# Altium project PCB_Multimeter.PrjPcb
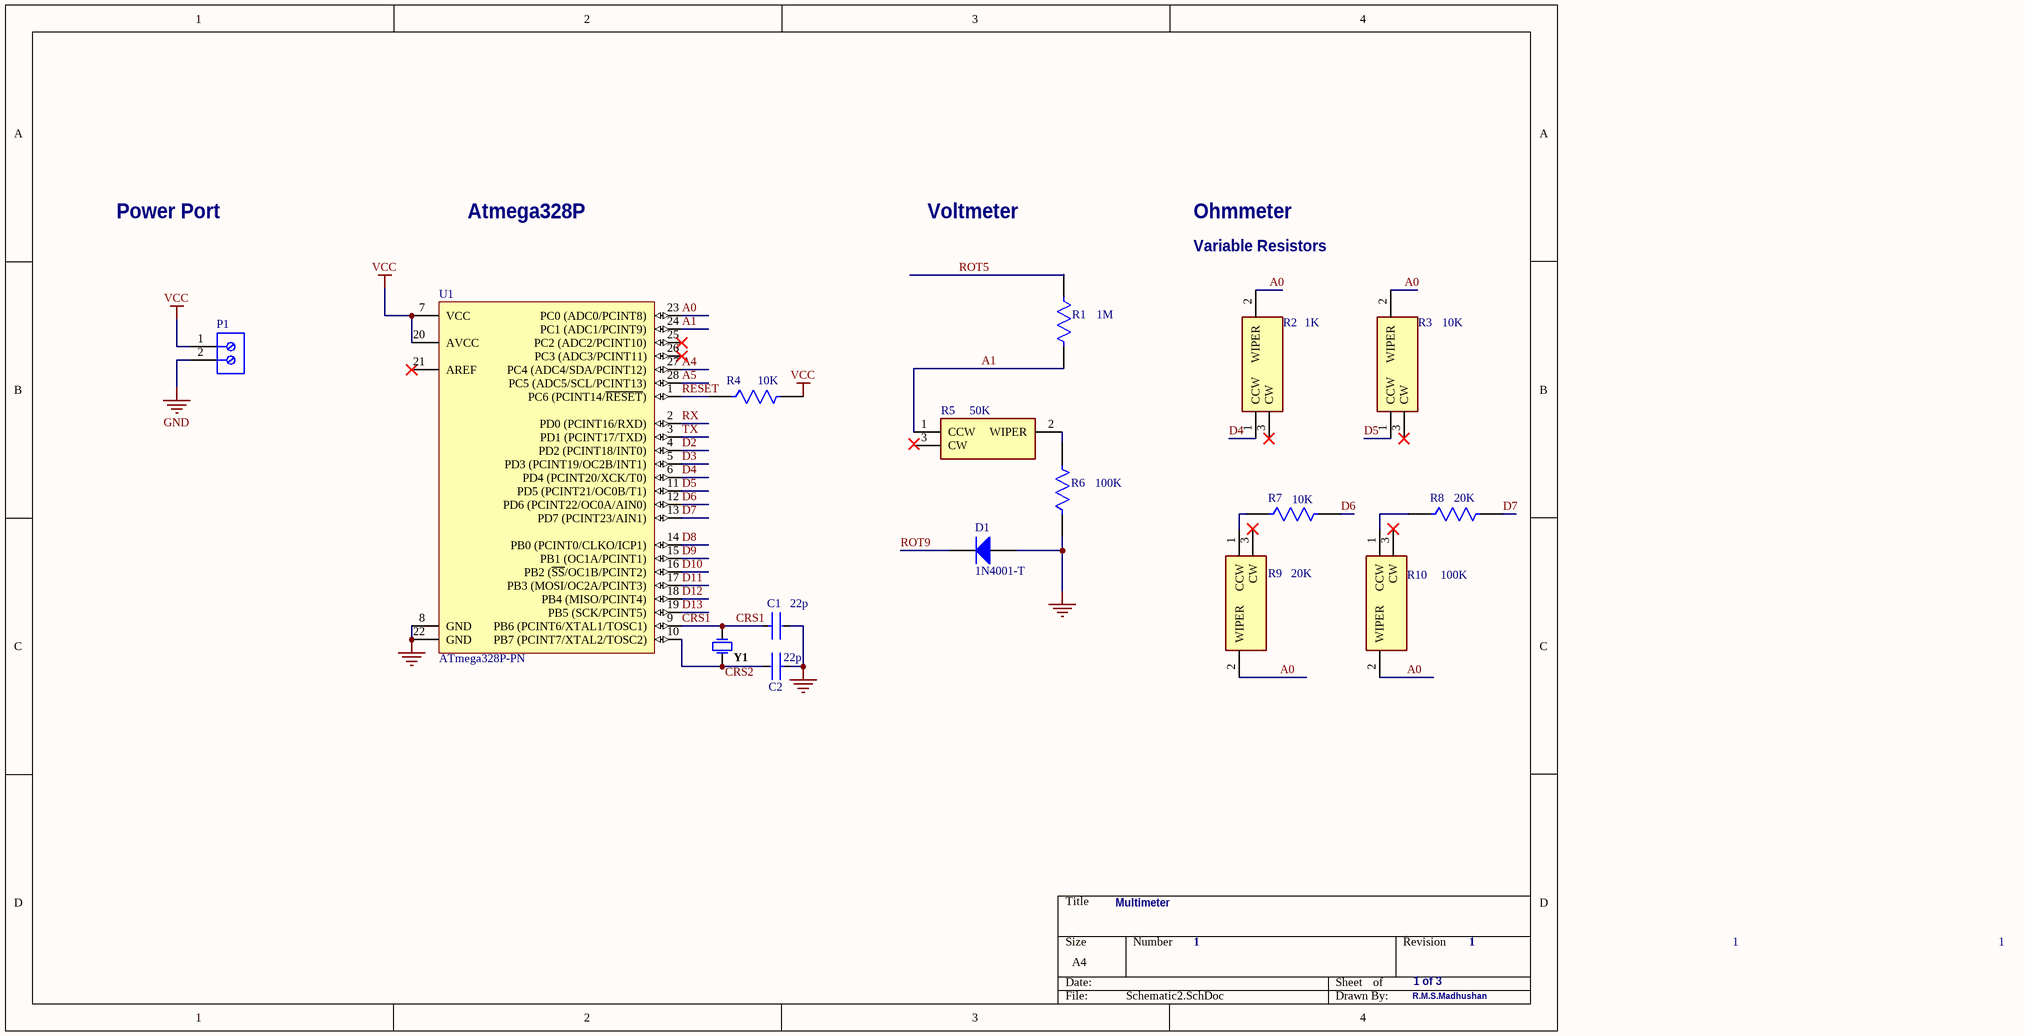
[diagram p0: Schematic2.SchDoc]
Start: 2023; Title: Multimeter
3 sheets, 46 parts. Net scope: global (net labels, ports and power ports of the same name join across sheets).
Board files: PCB1.PcbDoc, PCB2.PcbDoc
Sheets:
  Schematic2.SchDoc
  Sheet2.SchDoc
  Sheet3.SchDoc

## Sheet Schematic2.SchDoc: Multimeter
size A4; DrawnBy: R.M.S.Madhushan; SheetNumber: 1; SheetTotal: 3

### Parts
C1  22p  [FP-RDE0M1-MFG]
C2  22p  [FP-RDE0M1-MFG]
D1  1N4001-T  [DIOD-DO-41-P-2_V]
P1  691214110002  [691214110002]  (value not drawn)
R1  1M  [FP-G001R1000FE1280-MFG]
R2  1K  [3362P_1]
R3  10K  [3362P_1]
R4  10K  [FP-G001R1000FE1280-MFG]
R5  50K  [3362P_1]
R6  100K  [FP-G001R1000FE1280-MFG]
R7  10K  [FP-G001R1000FE1280-MFG]
R8  20K  [FP-G001R1000FE1280-MFG]
R9  20K  [3362P_1]
R10  100K  [3362P_1]
U1  ATmega328P-PN  [28P3]
Y1  FOXSLF/160-20  [FOX-FOXSLF160-20]  (value not drawn)

### Nets
GND: C1.2 C2.1 D1.1(A) P1.2 R6.1 U1.8(GND) U1.22(GND)
VCC: P1.1 R4.2 U1.7(VCC) U1.20(AVCC)
A0: R2.2(WIPER) R3.2(WIPER) R9.2(WIPER) R10.2(WIPER) U1.23(PC0_(ADC0/PCINT8))
A1: R1.2 R5.1(CCW) U1.24(PC1_(ADC1/PCINT9))
A4: U1.27(PC4_(ADC4/SDA/PCINT12))
A5: U1.28(PC5_(ADC5/SCL/PCINT13))
CRS1: C1.1 U1.9(PB6_(PCINT6/XTAL1/TOSC1)) Y1.1
D2: U1.4(PD2_(PCINT18/INT0))
D3: U1.5(PD3_(PCINT19/OC2B/INT1))
D4: R2.1(CCW) U1.6(PD4_(PCINT20/XCK/T0))
D5: R3.1(CCW) U1.11(PD5_(PCINT21/OC0B/T1))
D6: R7.2 U1.12(PD6_(PCINT22/OC0A/AIN0))
D7: R8.2 U1.13(PD7_(PCINT23/AIN1))
D8: U1.14(PB0_(PCINT0/CLKO/ICP1))
D9: U1.15(PB1_(OC1A/PCINT1))
D10: U1.16(PB2_(~{SS}/OC1B/PCINT2))
D11: U1.17(PB3_(MOSI/OC2A/PCINT3))
D12: U1.18(PB4_(MISO/PCINT4))
D13: U1.19(PB5_(SCK/PCINT5))
RESET: R4.1 U1.1(PC6_(PCINT14/~{RESET}))
ROT5: R1.1
ROT9: D1.2(K)
RX: U1.2(PD0_(PCINT16/RXD))
TX: U1.3(PD1_(PCINT17/TXD))
NetC2_2: C2.2 U1.10(PB7_(PCINT7/XTAL2/TOSC2)) Y1.2
NetR5_2: R5.2(WIPER) R6.2
NetR7_1: R7.1 R9.1(CCW)
NetR8_1: R8.1 R10.1(CCW)

Not connected (* = marked no-connect by the designer): R2 3(CW)*; R3 3(CW)*; R5 3(CW); R9 3(CW)*; R10 3(CW)*; U1 21(AREF)* 25(PC2_(ADC2/PCINT10))* 26(PC3_(ADC3/PCINT11))*

### Notes on the sheet
- Power Port
- Atmega328P
- Voltmeter
- Ohmmeter
- Variable Resistors
- Multimeter
- 1
- 1 of 3
- Labels drawn without touching a wire or pin: CRS2

### Library data of the parts
C1 C2 = CMP-06035-055552-1: Ceramic Capacitor 22pF ±5% 50V C0G Radial; Lead Diameter: 0.5mm; Capacitance: 22pF; Width: 0.098inch; Dielectric: C0G; Length: 0.157inch; Max Operating Temperature: 125°C; Case/Package: Radial; Voltage Rating (DC): 50V; Lead Free: Lead Free; Voltage Rating: 50V; Termination: Radial; Mount: Through Hole; Tolerance: 5%; Resistor Type: Ceramic; Packaging: Bulk; Package Quantity: 500; Lead Pitch: 0.197inch; Min Operating Temperature: -55°C; Height - Seated (Max): 0.236inch; Height: 3.5mm
D1 = CMP-0639-00006-2: 1.0 A Rectifier, 15 pF, 50 V, -65 to 150 degC, 2-Pin DO-41 Plastic, RoHS, Tape and Reel; Manufacturer: Diodes Inc; VF (V): 1; CT (pF): 15; Max. IR (uA): 5; VRRM (V): 50; Max. IFSM (A): 30; RoHS: TRUE; Mounting Technology: Through Hole; PartNumber: 1N4001-T; ComponentLink2Description: Datasheet; DatasheetVersion: Rev. 8-2; Operating Temperature Range (degC): -65 to 150; Packing: Tape and Reel; PackageReference: DO-41-P-2; ComponentLink1URL: http://diodes.com/; PackageDescription: 2-Pin Axial Lead, Body 4.635 x 2.36 mm, Lead Spread 25.4 mm; ComponentLink2URL: http://diodes.com/datasheets/ds28002.pdf; Max. Average Rectified Current IO (A): 1; ComponentLink1Description: Manufacturer URL
P1 = CMP-1502-02464-1: Serie 2141 - 3.50 mm Horizontal Entry Modular with Rising Cage Clamp WR-TBL, 2 pin; Manufacturer: Wurth Elektronik; Pin Number: 2; Pitch: 3.50mm; Datasheet URL: http://katalog.we-online.de/em/datasheet/6912141100xx.pdf; Packaging: Box; Mounting Technology: THT; Package Reference: 691214110002; Manufacturer URL: http://www.we-online.de; Part Number: 691214110002; Publisher: WurthElektronik; Operating Temperature: -40to105degC
R1 R4 R6-R8 = CMP-02408-000025-1: Res Wirewound 0.1 Ohm 1% 1W ±90ppm/°C Ceramic Hi Temp Sil AXL Thru-Hole Bulk; Resistance: 100mR; Case/Package: Ceramic; Construction: Cylindrical; Diameter: 2.16mm; Series: G; Tolerance: 1%; Max Operating Temperature: 250°C; Lead Free: Lead Free; Resistor Type: Wirewound; Contact Plating: Tin; Mount: Through Hole; Radiation Hardening: No; RoHS Compliant: Yes; Termination: Axial; Temperature Coefficient: 90ppm/°C; Min Operating Temperature: -65°C; Length: 7.14mm; Military Standard: Not; Packaging: Tape and Reel; Power Rating: 1W
R2 R3 R5 R9 R10 = 3362P-1-203LF: Resistor; Manufacturer_Name: Bourns; Datasheet Link: https://www.bourns.com/docs/Product-Datasheets/3362.pdf; Manufacturer_Part_Number: 3362P-1-203LF; Mouser Part Number: 652-3362P-1-203LF; Mouser Price/Stock: https://www.mouser.co.uk/ProductDetail/Bourns/3362P-1-203LF?qs=GslmPyR0hhF1JBua3W6Xbw%3D%3D; Arrow Part Number: 3362P-1-203LF; Arrow Price/Stock: https://www.arrow.com/en/products/3362p-1-203lf/bourns?region=europe
U1 = CMP-0095-00355-1: 8-bit AVR Microcontroller, 32KB Flash, 1KB EEPROM, 2KB SRAM, 28-pin PDIP, Industrial Grade (-40°C to 105°C); PackageVersion: revB, Sep-2001; ComponentLink1Description: Manufacturer URL; ComponentLink1URL: http://www.atmel.com/; ComponentLink2URL: http://www.atmel.com/dyn/resources/prod_documents/8271.pdf; PackageDescription: 28-lead (0.300"/7.62mm Wide) Plastic Dual Inline Package (PDIP); ComponentLink2Description: ATmega48A/48PA/88A/88PA/168A/168PA/328/328P Datasheet; ComponentLink3Description: ATmega48A/48PA/88A/88PA/168A/168PA/328/328P Summary; DatasheetVersion: revD, May-2011; ComponentLink3URL: http://www.atmel.com/dyn/resources/prod_documents/8271S.pdf; PackageReference: 28P3
Y1 = CMP-1749-00003-1: Resistance Weld Thru-Hole Crystal, 16 MHz, -20 to 70 degC, 2-Pin THD, RoHS, Bulk; Voltage Rating: 250 V; Tolerance: 1%; Resistance: 221 kohm; Case\Package: Axial; Power Rating: 250 mW; RoHSCompliant: true; Package Quantity: 200; Packaging: Bulk; Min Operating Temperature: -55 degC; DatasheetVersion: Mar-15; ComponentLink1URL: http://www.foxonline.com/; Max Operating Temperature: 155 degC; PackageReference: FOXSLF160-20; Mount: Through Hole; PackageDescription: 2-Pin Through Hole Device, Body 11.35 x 4.65 mm; ComponentLink1Description: Manufacturer URL; ComponentLink2URL: http://www.foxonline.com/pdfs/hc49slf.pdf; ComponentLink2Description: Datasheet; Length: 0.248 inch

## Sheet Sheet2.SchDoc: Multimeter
size A4; SheetNumber: 2; SheetTotal: 3
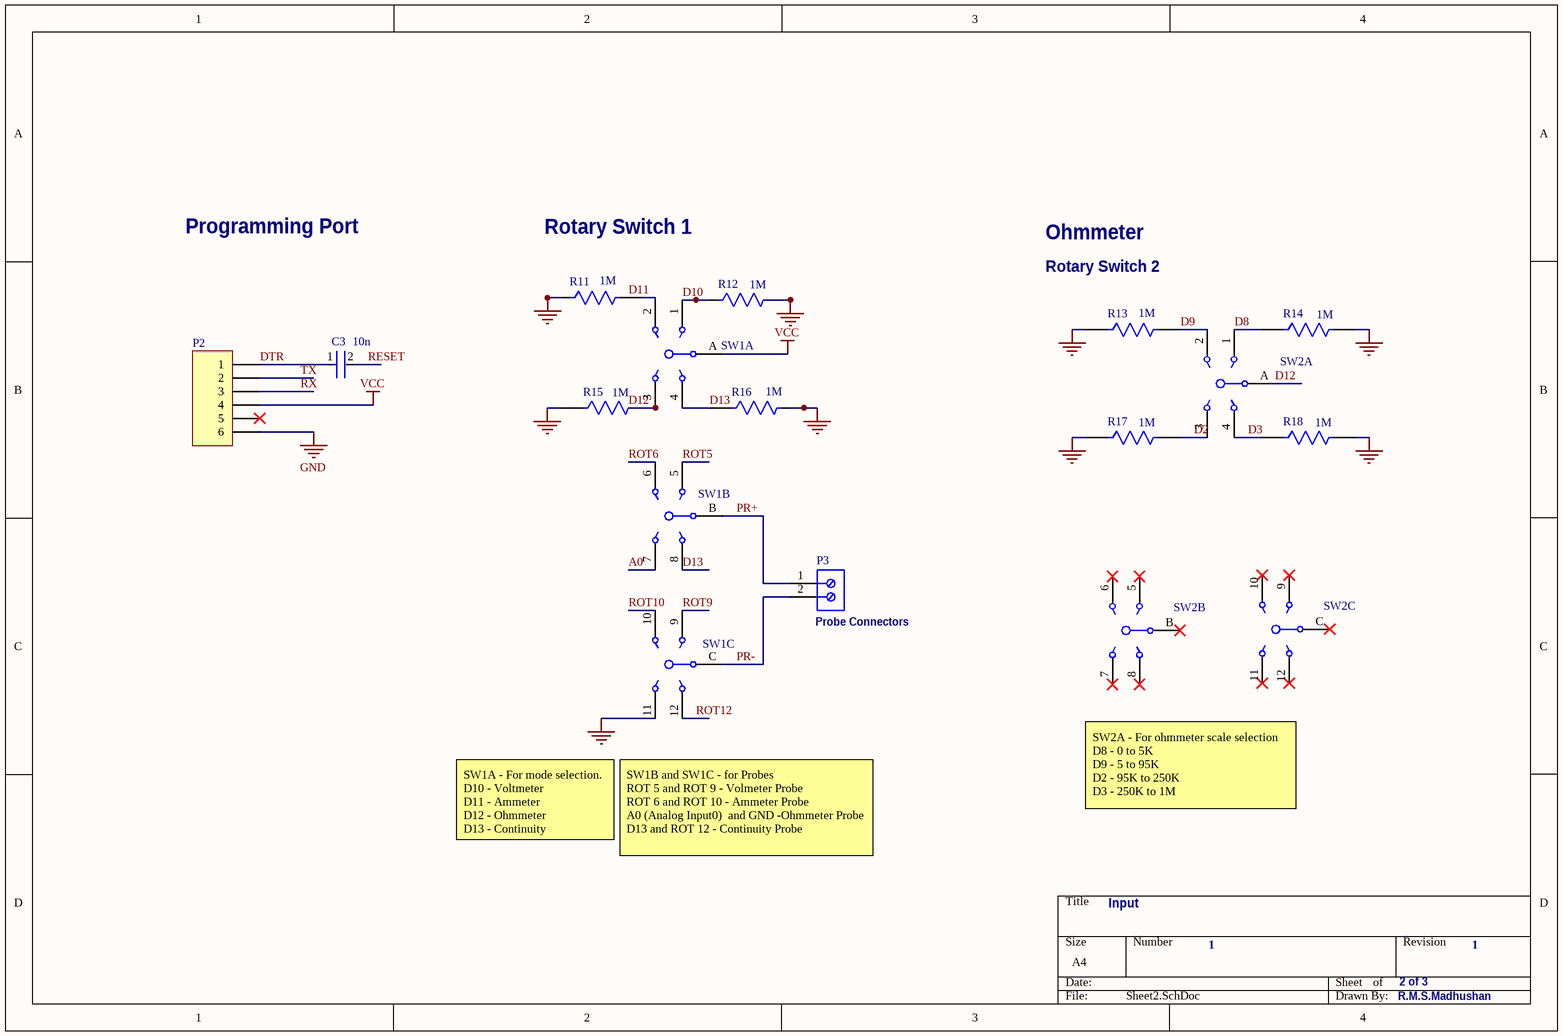
[diagram p1: Sheet2.SchDoc]

### Parts
(Parts that share a designator on the sheet are numbered #1, #2 ... from top to bottom, then left to right.)
C3  10n  [FP-RDE0M1-MFG]
P2  Header 6  [MY_FE06W]  (value not drawn)
P3  691214110002  [691214110002]  (value not drawn)
R11  1M  [FP-G001R1000FE1280-MFG]
R12  1M  [FP-G001R1000FE1280-MFG]
R13  1M  [FP-G001R1000FE1280-MFG]
R14  1M  [FP-G001R1000FE1280-MFG]
R15  1M  [FP-G001R1000FE1280-MFG]
R16#1  1M  [FP-G001R1000FE1280-MFG]
R17  1M  [FP-G001R1000FE1280-MFG]
R18  1M  [FP-G001R1000FE1280-MFG]
SW1  A30403RNZQ  [CKCP-A30403RNZQ-15_V]  (value not drawn)  (parts A,B,C of 3)
SW2  A30403RNZQ  [CKCP-A30403RNZQ-15_V]  (value not drawn)  (parts A,B,C of 3)

### Nets
GND: P2.6 R11.1 R12.2 R13.1 R14.2 R15.1 R16#1.2 R17.1 R18.2 SW1.11
VCC: P2.4 SW1.A
A0: SW1.7
D2: R17.2 SW2.3
D3: R18.1 SW2.4
D8: R14.1 SW2.1
D9: R13.2 SW2.2
D10: R12.1 SW1.1
D12: R15.2 SW1.3 SW2.A
D13: R16#1.1 SW1.4 SW1.8
DTR: C3.1 P2.1
PR+: P3.1 SW1.B
PR-: P3.2 SW1.C
RESET: C3.2
ROT5: SW1.5
ROT6: SW1.6
ROT9: SW1.9
ROT10: SW1.10
ROT12: SW1.12
RX: P2.3
TX: P2.2
NetR11_2: R11.2 SW1.2

Not connected (* = marked no-connect by the designer): P2 5*; SW2 5* 6* 7* 8* 9* 10* 11* 12* B* C*

### Notes on the sheet
- Programming Port
- Rotary Switch 1
- Ohmmeter
- (near R13) Rotary Switch 2
- (near P3) Probe Connectors
- SW1A - For mode selection.
  D10 - Voltmeter
  D11 - Ammeter
  D12 - Ohmmeter
  D13 - Continuity
- SW1B and SW1C - for Probes
  ROT 5 and ROT 9 - Volmeter Probe
  ROT 6 and ROT 10 - Ammeter Probe
  A0 (Analog Input0)  and GND -Ohmmeter Probe
  D13 and ROT 12 - Continuity Probe
- SW2A - For ohmmeter scale selection
  D8 - 0 to 5K
  D9 - 5 to 95K
  D2 - 95K to 250K
  D3 - 250K to 1M
- Input
- 1
- 2 of 3
- R.M.S.Madhushan
- Labels drawn without touching a wire or pin: D11

### Library data of the parts
C3 = CMP-06035-055552-1: as C1 on sheet Schematic2; Capacitance: 22pF; Width: 0.098inch; Dielectric: C0G; Length: 0.157inch; Max Operating Temperature: 125°C; Case/Package: Radial; Voltage Rating (DC): 50V; Lead Free: Lead Free; Voltage Rating: 50V; Termination: Radial; Mount: Through Hole; Tolerance: 5%; Resistor Type: Ceramic; Packaging: Bulk; Package Quantity: 500; Lead Pitch: 0.197inch; Min Operating Temperature: -55°C; Height - Seated (Max): 0.236inch; Height: 3.5mm
P2 = Header 6: Header, 6-Pin; ASiD Part Number: Header 6-AS
P3 = CMP-1502-02464-1: as P1 on sheet Schematic2; Datasheet URL: http://katalog.we-online.de/em/datasheet/6912141100xx.pdf; Packaging: Box; Mounting Technology: THT; Package Reference: 691214110002; Manufacturer URL: http://www.we-online.de; Part Number: 691214110002; Publisher: WurthElektronik; Operating Temperature: -40to105degC
R11-R15 R16#1 R17 R18 = CMP-02408-000025-1: as R1 on sheet Schematic2; Case/Package: Ceramic; Construction: Cylindrical; Diameter: 2.16mm; Series: G; Tolerance: 1%; Max Operating Temperature: 250°C; Lead Free: Lead Free; Resistor Type: Wirewound; Contact Plating: Tin; Mount: Through Hole; Radiation Hardening: No; RoHS Compliant: Yes; Termination: Axial; Temperature Coefficient: 90ppm/°C; Min Operating Temperature: -65°C; Length: 7.14mm; Military Standard: Not; Packaging: Tape and Reel; Power Rating: 1W
SW1 SW2 = CMP-1076-00008-1: A Series Rotary Switch, 3 Poles, 4 Positions, 30 deg Angle of Throw, -30 to 85 degC, RoHS; Manufacturer: C&K Components; Angle of Throw: 30 deg; Position: 4; Pole: 3; Series: A; Temperature Range: -30 to 85 degC; PackageDescription: 15-Pin Through Hole Device, Dia 26.19 mm, Height 32.02 mm; RoHS: TRUE; ComponentLink1URL: http://www.ck-components.com/; ComponentLink3Description: Package Specification; ComponentLink2Description: Datasheet; PartNumber: A30403RNZQ; DatasheetVersion: 41821; ComponentLink1Description: Manufacturer URL; Mounting Technology: Through Hole; PackageReference: A30403RNZQ-15; ComponentLink2URL: http://www.ck-components.com/13397/arotary_9apr14.pdf/; ComponentLink3URL: http://www.ck-components.com/13397/arotary_9apr14.pdf/

## Sheet Sheet3.SchDoc: Multimeter
size A4; SheetNumber: 3; SheetTotal: 3
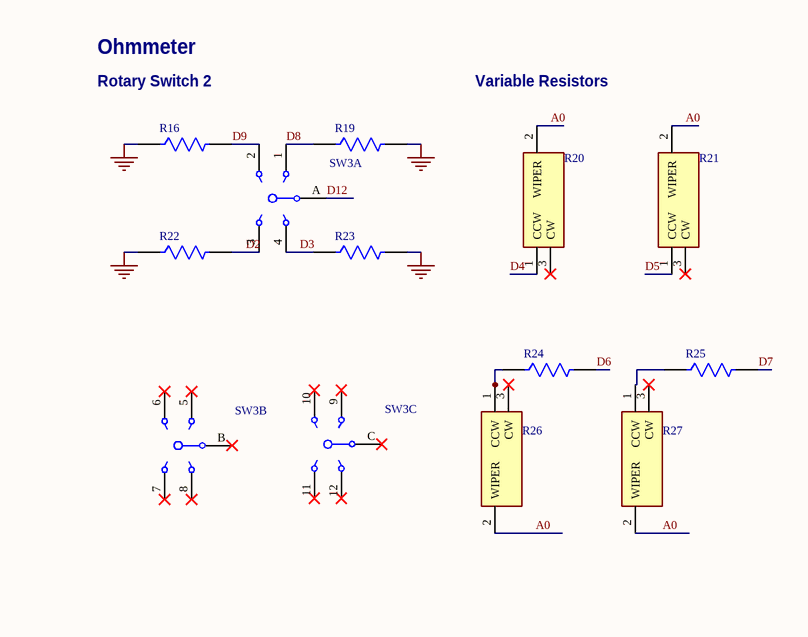
[diagram p2: Sheet3.SchDoc, top right]
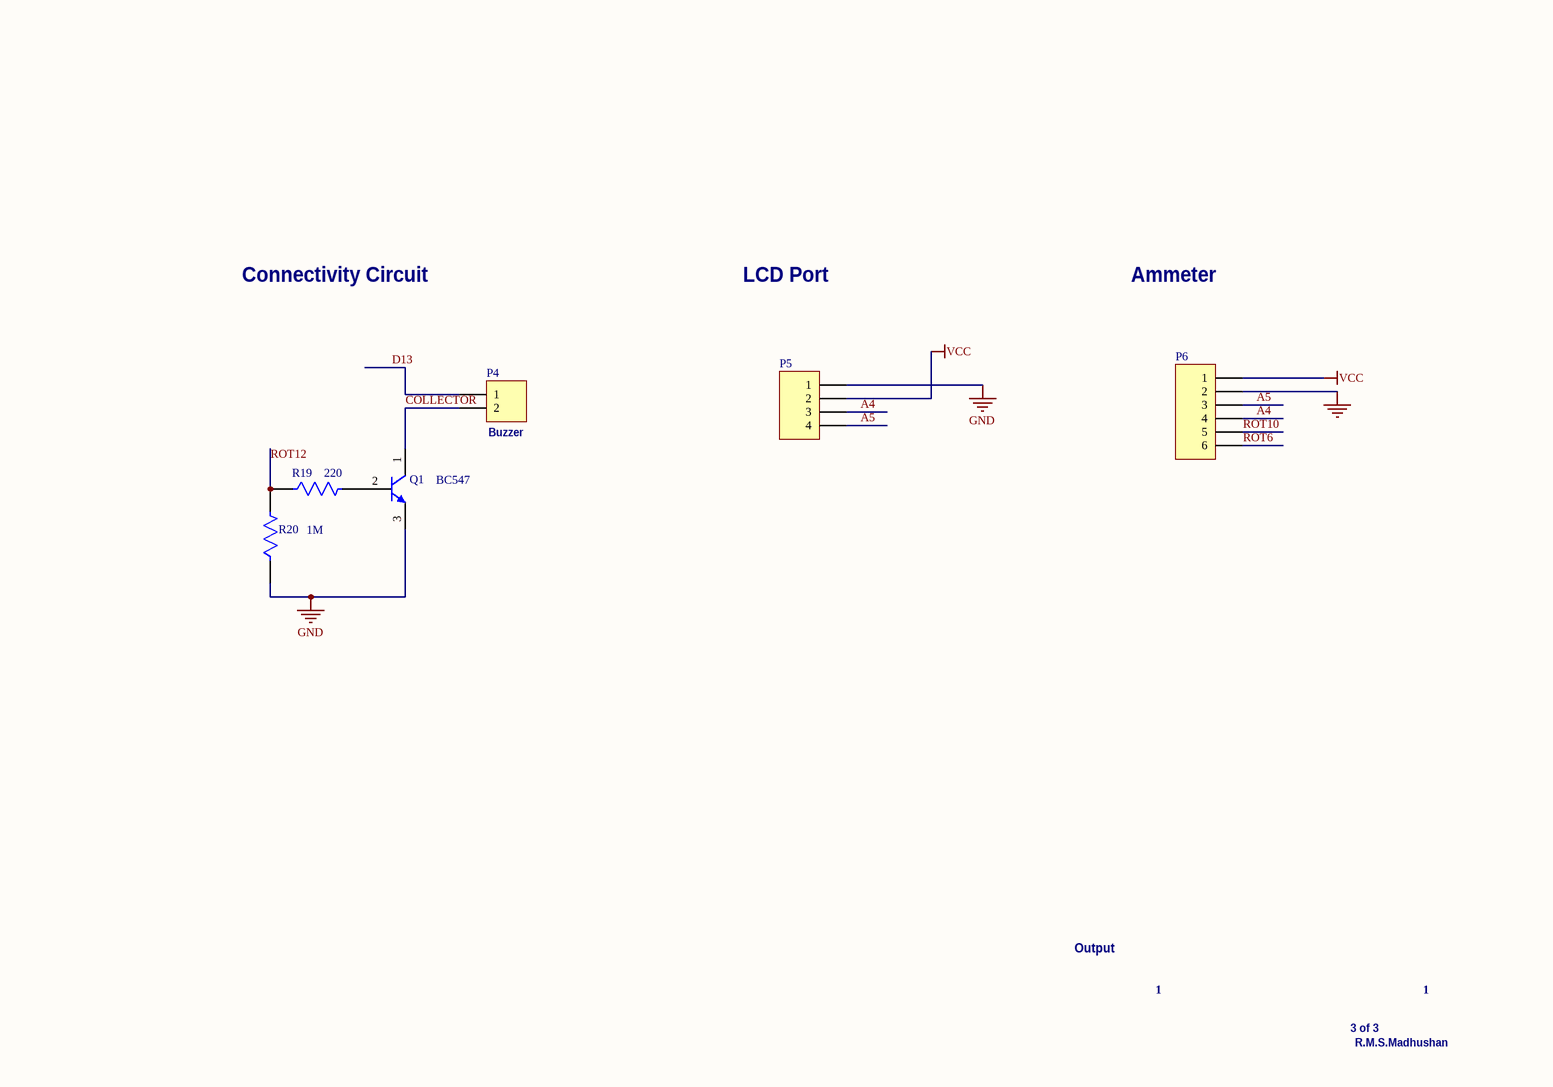
[diagram p3: Sheet3.SchDoc, bottom left]

### Parts
(Parts that share a designator on the sheet are numbered #1, #2 ... from top to bottom, then left to right.)
P4  Header 2  [MY_FE02W]  (value not drawn)
P5  Header 4  [MY_FE04W]  (value not drawn)
P6  Header 6  [MY_FE06W]  (value not drawn)
Q1  BC547  [ONSC-TO-92-3-29-11_AM_BL]
R16#2  G001R1000FE1280  [FP-G001R1000FE1280-MFG]  (value not drawn)
R19#1  G001R1000FE1280  [FP-G001R1000FE1280-MFG]  (value not drawn)
R19#2  220  [FP-G001R1000FE1280-MFG]
R20#1  3362P-1-203LF  [3362P_1]  (value not drawn)
R20#2  1M  [FP-G001R1000FE1280-MFG]
R21  3362P-1-203LF  [3362P_1]  (value not drawn)
R22  G001R1000FE1280  [FP-G001R1000FE1280-MFG]  (value not drawn)
R23  G001R1000FE1280  [FP-G001R1000FE1280-MFG]  (value not drawn)
R24  G001R1000FE1280  [FP-G001R1000FE1280-MFG]  (value not drawn)
R25  G001R1000FE1280  [FP-G001R1000FE1280-MFG]  (value not drawn)
R26  3362P-1-203LF  [3362P_1]  (value not drawn)
R27  3362P-1-203LF  [3362P_1]  (value not drawn)
SW3  A30403RNZQ  [CKCP-A30403RNZQ-15_V]  (value not drawn)  (parts A,B,C of 3)

### Nets
GND: P5.1 P6.2 Q1.3(E) R16#2.1 R19#1.2 R20#2.1 R22.1 R23.2
VCC: P5.2 P6.1
A0: R20#1.2(WIPER) R21.2(WIPER) R26.2(WIPER) R27.2(WIPER)
A4: P5.3 P6.4
A5: P5.4 P6.3
COLLECTOR: P4.2 Q1.1(C)
D2: R22.2 SW3.3
D3: R23.1 SW3.4
D4: R20#1.1(CCW)
D5: R21.1(CCW)
D6: R24.2
D7: R25.2
D8: R19#1.1 SW3.1
D9: R16#2.2 SW3.2
D12: SW3.A
D13: P4.1
ROT6: P6.6
ROT10: P6.5
ROT12: R19#2.1 R20#2.2
NetQ1_2: Q1.2(B) R19#2.2
NetR24_1: R24.1 R26.1(CCW)
NetR25_1: R25.1 R27.1(CCW)

Not connected (* = marked no-connect by the designer): R20#1 3(CW)*; R21 3(CW)*; R26 3(CW)*; R27 3(CW)*; SW3 5* 6* 7* 8* 9* 10* 11* 12* B* C*

### Notes on the sheet
- Ohmmeter
- (near R16#2) Rotary Switch 2
- Variable Resistors
- Connectivity Circuit
- LCD Port
- Ammeter
- (near P4) Buzzer
- Output
- 1
- 3 of 3
- R.M.S.Madhushan

### Library data of the parts
P4 = Header 2: Header, 2-Pin; ASiD Part Number: Header 2-AS
P5 = Header 4: Header, 4-Pin; ASiD Part Number: Header 4-AS
P6 = Header 6: as P2 on sheet Sheet2
Q1 = CMP-1048-01605-1: Amplifier Transistor, NPN Silicon, 3-Pin TO-92, Pb-Free, Tape and Reel; Manufacturer: On Semiconductor; PartNumber: BC547BRL1G; IC Continuous (A): 0.1; fT Min (MHz): 150; ComponentLink2URL: http://www.onsemi.com/pub_link/Collateral/BC546-D.PDF; ComponentLink1URL: http://www.onsemi.com/; ComponentLink2Description: Datasheet; RoHS: TRUE; ComponentLink3Description: Package Specification; ComponentLink1Description: Manufacturer URL; ComponentLink3URL: http://www.onsemi.com/pub_link/Collateral/MAC97-D.PDF; PackageDescription: 3-Pin Transistor Outline, Body 4.825 x 3.685 mm, Pitch 1.27 mm; Packing: Tape and Reel; PackageVersion: Rev. AM; Polarity: NPN; DatasheetVersion: Rev. 7; Mounting Technology: Through Hole; PackageReference: TO-92-3-29-11_AM_BL
R16#2 R19#1 R19#2 R20#2 R22-R25 = CMP-02408-000025-1: as R1 on sheet Schematic2; Case/Package: Ceramic; Construction: Cylindrical; Diameter: 2.16mm; Series: G; Tolerance: 1%; Max Operating Temperature: 250°C; Lead Free: Lead Free; Resistor Type: Wirewound; Contact Plating: Tin; Mount: Through Hole; Radiation Hardening: No; RoHS Compliant: Yes; Termination: Axial; Temperature Coefficient: 90ppm/°C; Min Operating Temperature: -65°C; Length: 7.14mm; Military Standard: Not; Packaging: Tape and Reel; Power Rating: 1W
R20#1 R21 R26 R27 = 3362P-1-203LF: Resistor; Manufacturer_Name: Bourns; Datasheet Link: https://www.bourns.com/docs/Product-Datasheets/3362.pdf; Manufacturer_Part_Number: 3362P-1-203LF; Mouser Part Number: 652-3362P-1-203LF; Mouser Price/Stock: https://www.mouser.co.uk/ProductDetail/Bourns/3362P-1-203LF?qs=GslmPyR0hhF1JBua3W6Xbw%3D%3D; Arrow Part Number: 3362P-1-203LF; Arrow Price/Stock: https://www.arrow.com/en/products/3362p-1-203lf/bourns?region=europe
SW3 = CMP-1076-00008-1: as SW1 on sheet Sheet2; Series: A; Temperature Range: -30 to 85 degC; PackageDescription: 15-Pin Through Hole Device, Dia 26.19 mm, Height 32.02 mm; RoHS: TRUE; ComponentLink1URL: http://www.ck-components.com/; ComponentLink3Description: Package Specification; ComponentLink2Description: Datasheet; PartNumber: A30403RNZQ; DatasheetVersion: 41821; ComponentLink1Description: Manufacturer URL; Mounting Technology: Through Hole; PackageReference: A30403RNZQ-15; ComponentLink2URL: http://www.ck-components.com/13397/arotary_9apr14.pdf/; ComponentLink3URL: http://www.ck-components.com/13397/arotary_9apr14.pdf/

## Nets that join several sheets
GND: Schematic2 (7 pins), Sheet2 (10 pins), Sheet3 (8 pins)
VCC: Schematic2 (P1.1 R4.2 U1.7 U1.20), Sheet2 (P2.4 SW1.A), Sheet3 (P5.2 P6.1)
A0: Schematic2 (5 pins), Sheet2 (SW1.7), Sheet3 (R20#1.2 R21.2 R26.2 R27.2)
A4: Schematic2 (U1.27), Sheet3 (P5.3 P6.4)
A5: Schematic2 (U1.28), Sheet3 (P5.4 P6.3)
D2: Schematic2 (U1.4), Sheet2 (R17.2 SW2.3), Sheet3 (R22.2 SW3.3)
D3: Schematic2 (U1.5), Sheet2 (R18.1 SW2.4), Sheet3 (R23.1 SW3.4)
D4: Schematic2 (R2.1 U1.6), Sheet3 (R20#1.1)
D5: Schematic2 (R3.1 U1.11), Sheet3 (R21.1)
D6: Schematic2 (R7.2 U1.12), Sheet3 (R24.2)
D7: Schematic2 (R8.2 U1.13), Sheet3 (R25.2)
D8: Schematic2 (U1.14), Sheet2 (R14.1 SW2.1), Sheet3 (R19#1.1 SW3.1)
D9: Schematic2 (U1.15), Sheet2 (R13.2 SW2.2), Sheet3 (R16#2.2 SW3.2)
D10: Schematic2 (U1.16), Sheet2 (R12.1 SW1.1)
D12: Schematic2 (U1.18), Sheet2 (R15.2 SW1.3 SW2.A), Sheet3 (SW3.A)
D13: Schematic2 (U1.19), Sheet2 (R16#1.1 SW1.4 SW1.8), Sheet3 (P4.1)
RESET: Schematic2 (R4.1 U1.1), Sheet2 (C3.2)
ROT5: Schematic2 (R1.1), Sheet2 (SW1.5)
ROT6: Sheet2 (SW1.6), Sheet3 (P6.6)
ROT9: Schematic2 (D1.2), Sheet2 (SW1.9)
ROT10: Sheet2 (SW1.10), Sheet3 (P6.5)
ROT12: Sheet2 (SW1.12), Sheet3 (R19#2.1 R20#2.2)
RX: Schematic2 (U1.2), Sheet2 (P2.3)
TX: Schematic2 (U1.3), Sheet2 (P2.2)